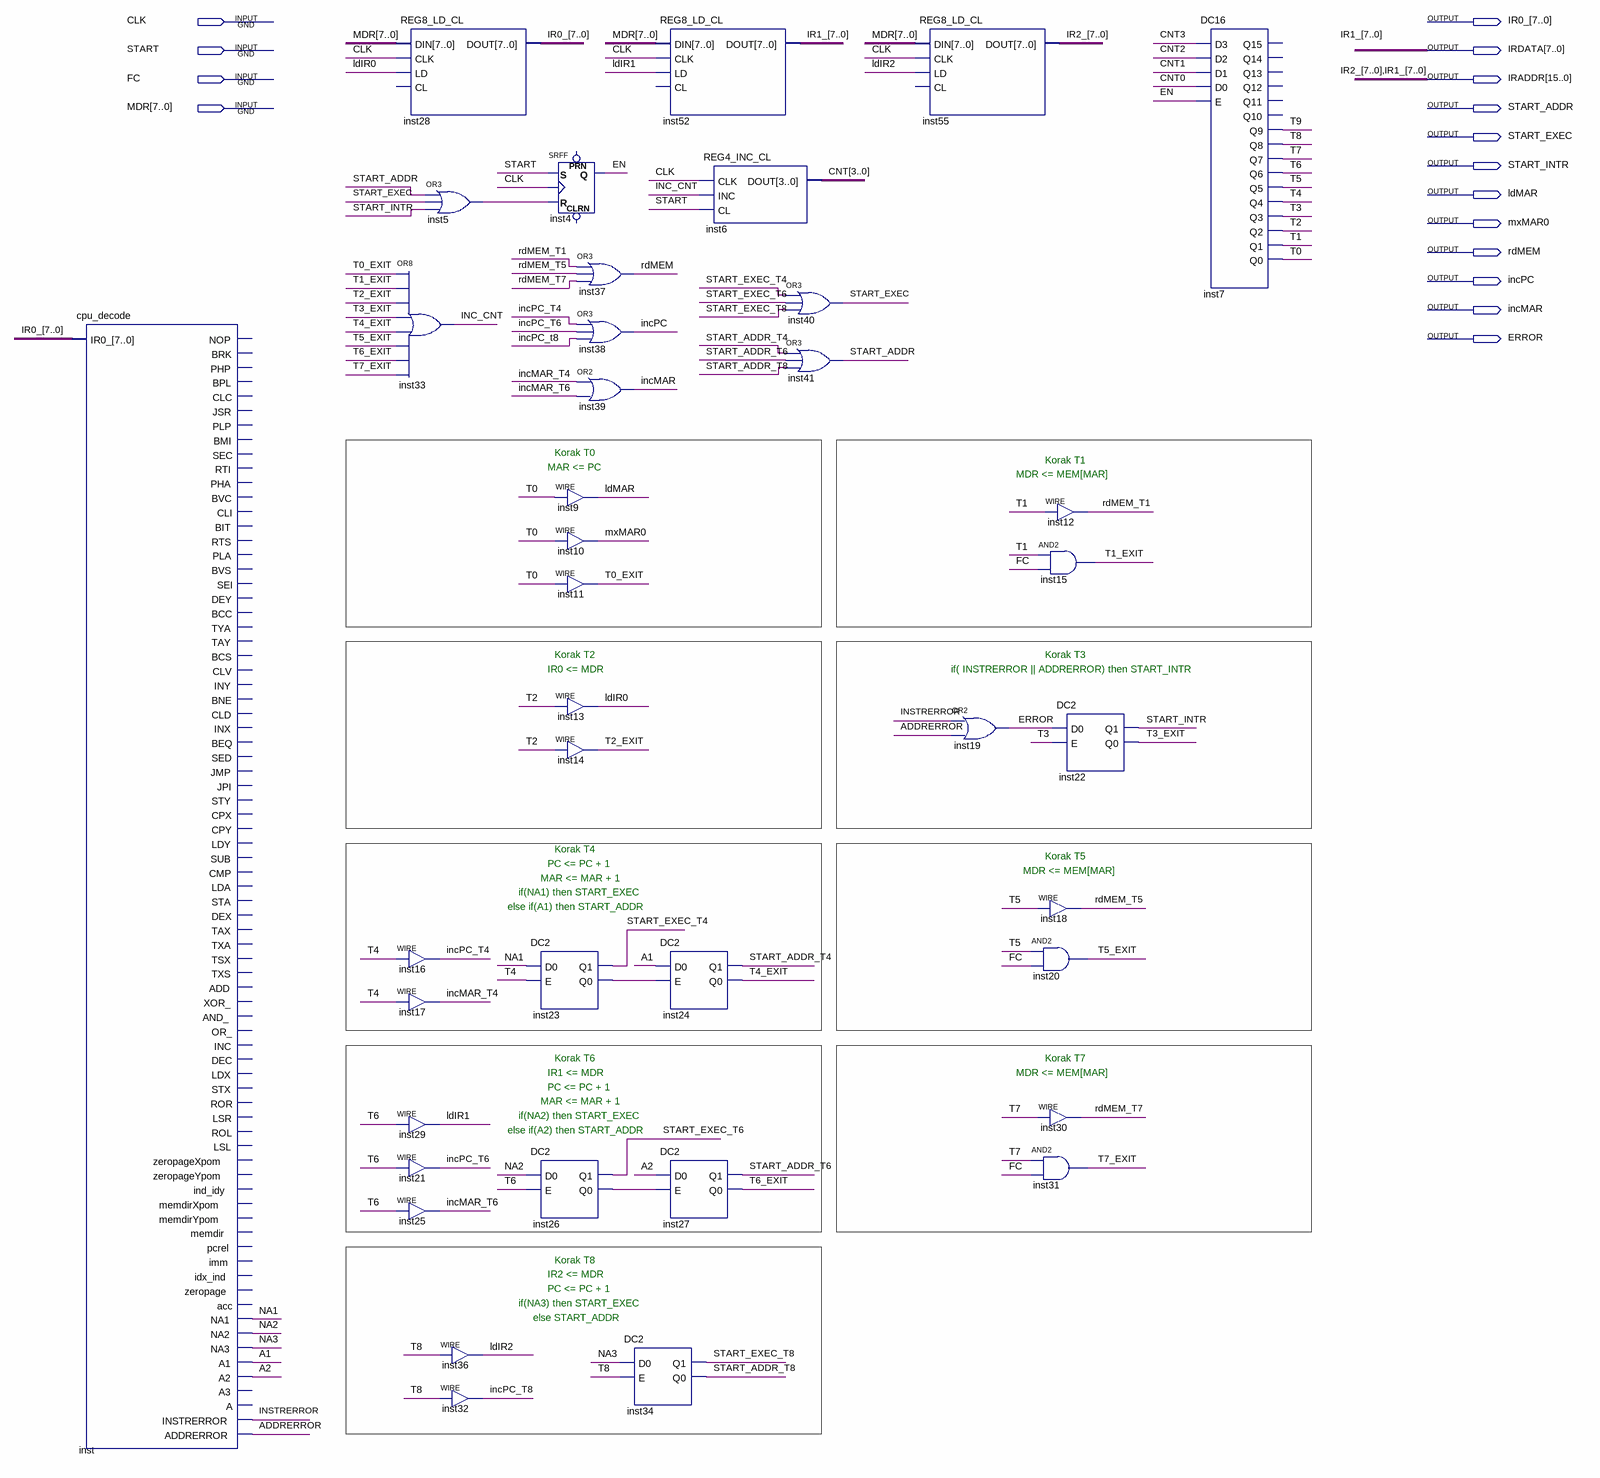
[diagram p0: schematic sheet]
// Quartus schematic cpu_fetch.bdf as structural Verilog: 39 symbols, 16 pins
module cpu_fetch (
  input  CLK,
  input  START,
  input  FC,
  input  [7:0] MDR,
  output [7:0] IR0_,
  output [7:0] IRDATA,
  output [15:0] IRADDR,
  output START_ADDR,
  output START_EXEC,
  output START_INTR,
  output ldMAR,
  output mxMAR0,
  output rdMEM,
  output incPC,
  output incMAR,
  output ERROR
);

  wire A1, A2, ADDRERROR, EN, INC_CNT, incMAR_T4, incMAR_T6, incPC_T4, incPC_T6, incPC_T8, inst5_out,
       inst23_q0, inst26_q0, INSTRERROR, ldIR0, ldIR1, ldIR2, NA1, NA2, NA3, rdMEM_T1, rdMEM_T5, rdMEM_T7,
       START_ADDR_T4, START_ADDR_T6, START_ADDR_T8, START_EXEC_T4, START_EXEC_T6, START_EXEC_T8, T0, T0_EXIT,
       T1, T1_EXIT, T2, T2_EXIT, T3, T3_EXIT, T4, T4_EXIT, T5, T5_EXIT, T6, T6_EXIT, T7, T7_EXIT, T8, T9;
  wire [3:0] CNT;

  cpu_decode inst (
    .IR0_(IR0_), .NA1(NA1), .NA2(NA2), .NA3(NA3), .A1(A1), .A2(A2), .INSTRERROR(INSTRERROR),
    .ADDRERROR(ADDRERROR));  // open: NOP, BRK, PHP, BPL, CLC, JSR, PLP, BMI, SEC, RTI, PHA, BVC, CLI, BIT, RTS, PLA, BVS, SEI, DEY, BCC, TYA, TAY, BCS, CLV, INY, BNE, CLD, INX, BEQ, SED, JMP, JPI, STY, CPX, CPY, LDY, SUB, CMP, LDA, STA, DEX, TAX, TXA, TSX, TXS, ADD, XOR_, AND_, OR_, INC, DEC, LDX, STX, ROR, LSR, ROL, LSL, zeropageXpom, zeropageYpom, ind_idy, memdirXpom, memdirYpom, memdir, pcrel, imm, idx_ind, zeropage, acc, A3, A
  REG8_LD_CL inst28 (.DIN(MDR), .CLK(CLK), .LD(ldIR0), .DOUT(IR0_));  // open: CL
  or inst33 (INC_CNT, T0_EXIT, T1_EXIT, T2_EXIT, T3_EXIT, T4_EXIT, T5_EXIT, T6_EXIT, T7_EXIT);
  assign incPC_T4 = T4;  // WIRE inst16
  assign incMAR_T4 = T4;  // WIRE inst17
  assign ldIR1 = T6;  // WIRE inst29
  assign incPC_T6 = T6;  // WIRE inst21
  assign incMAR_T6 = T6;  // WIRE inst25
  or inst5 (inst5_out, START_ADDR, START_EXEC, START_INTR);
  assign ldIR2 = T8;  // WIRE inst36
  assign incPC_T8 = T8;  // WIRE inst32
  SRFF inst4 (.S(START), .R(inst5_out), .CLK(CLK), .Q(EN));  // open: PRN, CLRN
  assign ldMAR = T0;  // WIRE inst9
  assign mxMAR0 = T0;  // WIRE inst10
  assign T0_EXIT = T0;  // WIRE inst11
  assign ldIR0 = T2;  // WIRE inst13
  assign T2_EXIT = T2;  // WIRE inst14
  DC2 inst23 (.D0(NA1), .E(T4), .Q1(START_EXEC_T4), .Q0(inst23_q0));
  DC2 inst26 (.D0(NA2), .E(T6), .Q1(START_EXEC_T6), .Q0(inst26_q0));
  or inst37 (rdMEM, rdMEM_T1, rdMEM_T5, rdMEM_T7);
  or inst38 (incPC, incPC_T4, incPC_T6, incPC_T8);
  or inst39 (incMAR, incMAR_T4, incMAR_T6);
  DC2 inst34 (.D0(NA3), .E(T8), .Q1(START_EXEC_T8), .Q0(START_ADDR_T8));
  REG8_LD_CL inst52 (.DIN(MDR), .CLK(CLK), .LD(ldIR1), .DOUT(IRADDR[7:0]));  // open: CL
  DC2 inst24 (.D0(A1), .E(inst23_q0), .Q1(START_ADDR_T4), .Q0(T4_EXIT));
  DC2 inst27 (.D0(A2), .E(inst26_q0), .Q1(START_ADDR_T6), .Q0(T6_EXIT));
  REG4_INC_CL inst6 (.CLK(CLK), .INC(INC_CNT), .CL(START), .DOUT(CNT));
  or inst40 (START_EXEC, START_EXEC_T4, START_EXEC_T6, START_EXEC_T8);
  or inst41 (START_ADDR, START_ADDR_T4, START_ADDR_T6, START_ADDR_T8);
  REG8_LD_CL inst55 (.DIN(MDR), .CLK(CLK), .LD(ldIR2), .DOUT(IRADDR[15:8]));  // open: CL
  or inst19 (ERROR, INSTRERROR, ADDRERROR);
  and inst20 (T5_EXIT, T5, FC);
  and inst31 (T7_EXIT, T7, FC);
  assign rdMEM_T1 = T1;  // WIRE inst12
  and inst15 (T1_EXIT, T1, FC);
  DC2 inst22 (.D0(ERROR), .E(T3), .Q1(START_INTR), .Q0(T3_EXIT));
  assign rdMEM_T5 = T5;  // WIRE inst18
  assign rdMEM_T7 = T7;  // WIRE inst30
  DC16 inst7 (
    .D3(CNT[3]), .D2(CNT[2]), .D1(CNT[1]), .D0(CNT[0]), .E(EN), .Q9(T9), .Q8(T8), .Q7(T7), .Q6(T6), .Q5(T5),
    .Q4(T4), .Q3(T3), .Q2(T2), .Q1(T1), .Q0(T0));  // open: Q15, Q14, Q13, Q12, Q11, Q10

  assign IRDATA = IRADDR[7:0];

  // Other names for the same wires on the sheet: IR1_[7:0] = IRADDR[7:0]; IR2_[7:0] = IRADDR[15:8]

  // Notes on the sheet:
  //   Korak T0
  //   Korak T1
  //   MAR <= PC
  //   MDR <= MEM[MAR]
  //   Korak T2
  //   Korak T3
  //   IR0 <= MDR
  //   if( INSTRERROR || ADDRERROR) then START_INTR
  //   Korak T4
  //   Korak T5
  //   PC <= PC + 1
  //   MDR <= MEM[MAR]
  //   MAR <= MAR + 1
  //   if(NA1) then START_EXEC
  //    else if(A1) then START_ADDR  
  //   Korak T6
  //   Korak T7
  //   IR1 <= MDR
  //   MDR <= MEM[MAR]
  //   PC <= PC + 1
  //   MAR <= MAR + 1
  //   if(NA2) then START_EXEC
  //    else if(A2) then START_ADDR  
  //   Korak T8
  //   IR2 <= MDR
  //   PC <= PC + 1
  //   if(NA3) then START_EXEC
  //   else START_ADDR
endmodule
